# EAGLE design SympleSensorBoard (EAGLE 9.6.2)
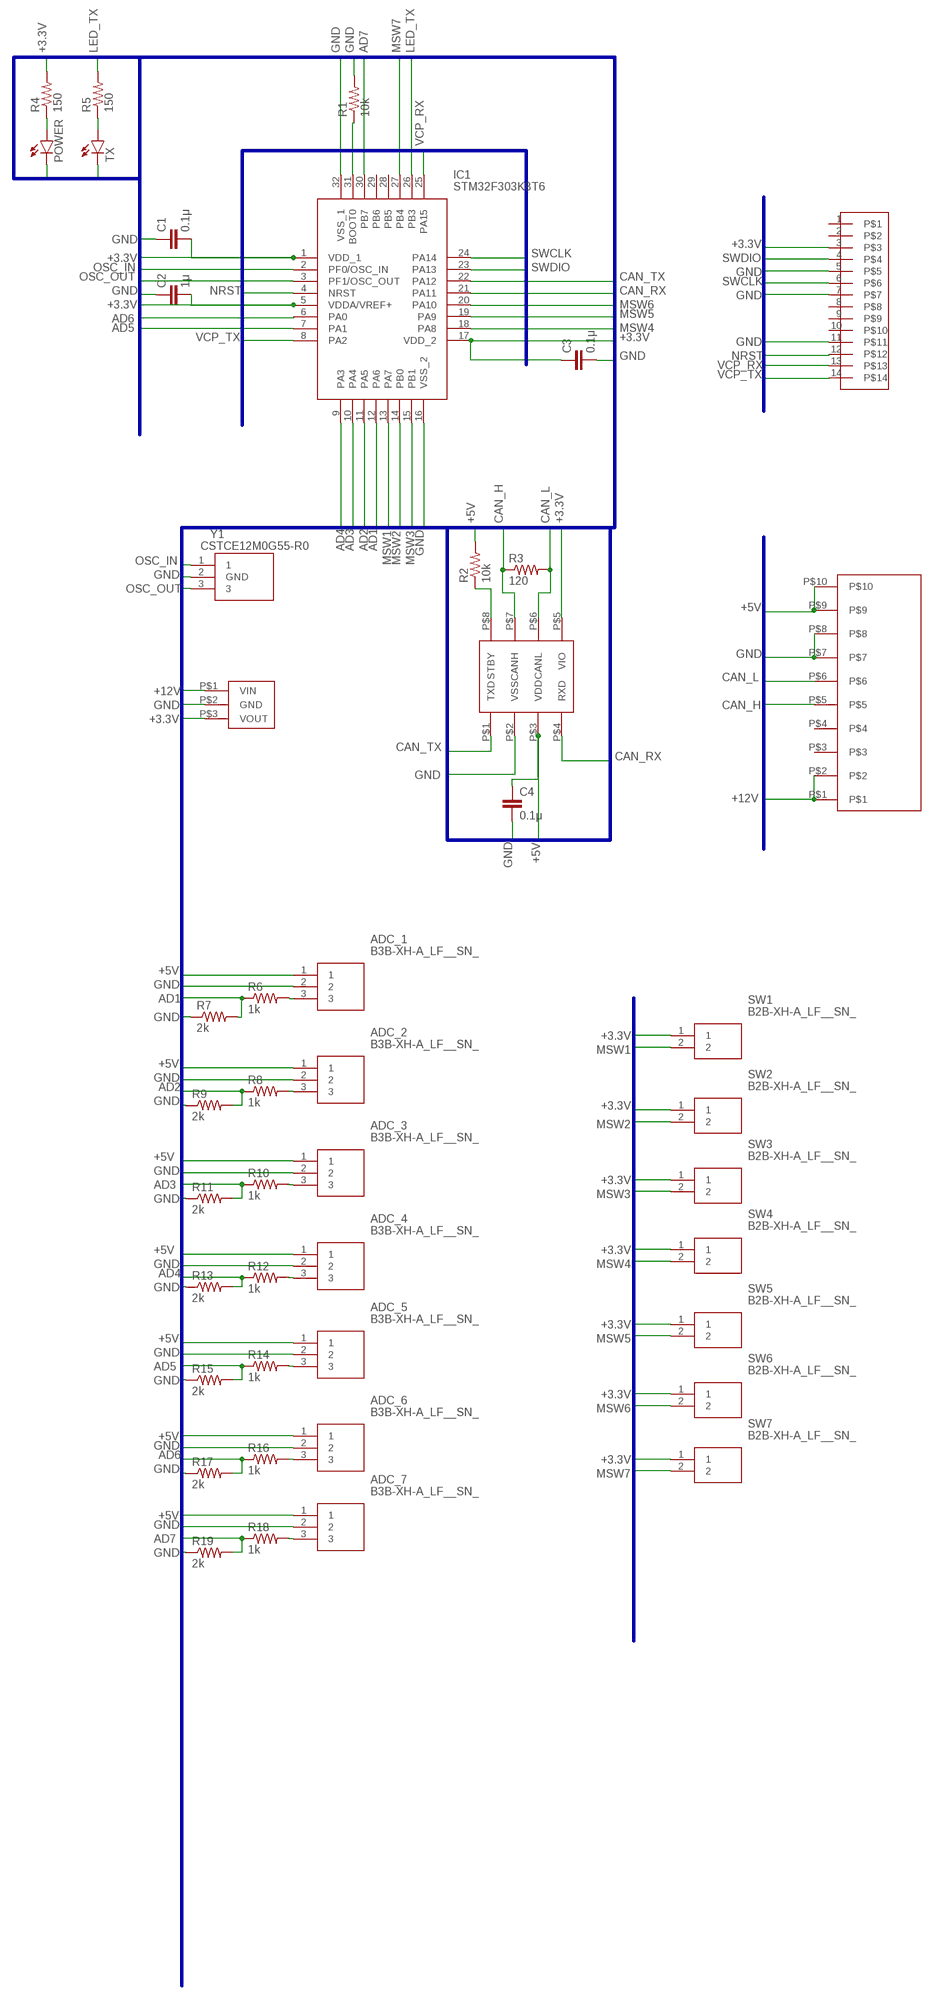
[diagram p0: schematic, sheet 1]

## Parts
ADC_1  B3B-XH-A_LF__SN_  [SHDR3W64P0X250_1X3_990X575X700]
ADC_2  B3B-XH-A_LF__SN_  [SHDR3W64P0X250_1X3_990X575X700]
ADC_3  B3B-XH-A_LF__SN_  [SHDR3W64P0X250_1X3_990X575X700]
ADC_4  B3B-XH-A_LF__SN_  [SHDR3W64P0X250_1X3_990X575X700]
ADC_5  B3B-XH-A_LF__SN_  [SHDR3W64P0X250_1X3_990X575X700]
ADC_6  B3B-XH-A_LF__SN_  [SHDR3W64P0X250_1X3_990X575X700]
ADC_7  B3B-XH-A_LF__SN_  [SHDR3W64P0X250_1X3_990X575X700]
C1  0.1μ  C-EUC0603  [C0603]
C2  1μ  C-EUC0603  [C0603]
C3  0.1μ  C-EUC0603  [C0603]
C4  0.1μ  C-EUC0603  [C0603]
IC1  STM32F303K8T6  [QFP80P900X900X160-32N]
POWER  LEDCHIP-LED0603  [CHIP-LED0603]
R1  10k  R-US_R0603  [R0603]
R2  10k  R-US_R0603  [R0603]
R3  120  R-US_R0603  [R0603]
R4  150  R-US_R0603  [R0603]
R5  150  R-US_R0603  [R0603]
R6  1k  R-US_R0603  [R0603]
R7  2k  R-US_R0603  [R0603]
R8  1k  R-US_R0603  [R0603]
R9  2k  R-US_R0603  [R0603]
R10  1k  R-US_R0603  [R0603]
R11  2k  R-US_R0603  [R0603]
R12  1k  R-US_R0603  [R0603]
R13  2k  R-US_R0603  [R0603]
R14  1k  R-US_R0603  [R0603]
R15  2k  R-US_R0603  [R0603]
R16  1k  R-US_R0603  [R0603]
R17  2k  R-US_R0603  [R0603]
R18  1k  R-US_R0603  [R0603]
R19  2k  R-US_R0603  [R0603]
SW1  B2B-XH-A_LF__SN_  [SHDR2W64P0X250_1X2_740X575X700]
SW2  B2B-XH-A_LF__SN_  [SHDR2W64P0X250_1X2_740X575X700]
SW3  B2B-XH-A_LF__SN_  [SHDR2W64P0X250_1X2_740X575X700]
SW4  B2B-XH-A_LF__SN_  [SHDR2W64P0X250_1X2_740X575X700]
SW5  B2B-XH-A_LF__SN_  [SHDR2W64P0X250_1X2_740X575X700]
SW6  B2B-XH-A_LF__SN_  [SHDR2W64P0X250_1X2_740X575X700]
SW7  B2B-XH-A_LF__SN_  [SHDR2W64P0X250_1X2_740X575X700]
TX  LEDCHIP-LED0603  [CHIP-LED0603]
U$1  BP5293-33  [DC/DC_REGULATOR_3P]
U$2  MCP2562MCP2561-SN  [SOIC8]
U$3  BOX14P  [CON_HEDA14P_1.27]
U$4  BOX10PBOX10P-L  [BOX10P-L]
Y1  CSTCE12M0G55-R0  [CSTCE12M0G55-R0]

## Nets
+3.3V: C1.2 C2.2 C3.1 IC1.1(VDD_1) IC1.5(VDDA/VREF+) IC1.17(VDD_2) R4.2 SW1.1 SW2.1 SW3.1 SW4.1 SW5.1 SW6.1 SW7.1 U$1.P$3(VOUT) U$2.P$5(VIO) U$3.3
+5V: ADC_1.1 ADC_2.1 ADC_3.1 ADC_4.1 ADC_5.1 ADC_6.1 ADC_7.1 C4.1 R2.2 U$2.P$3(VDD) U$4.P$9 U$4.P$10
+12V: U$1.P$1(VIN) U$4.P$1 U$4.P$2
AD1: IC1.12(PA6) R6.1 R7.2
AD2: IC1.11(PA5) R8.1 R9.2
AD3: IC1.10(PA4) R10.1 R11.2
AD4: IC1.9(PA3) R12.1 R13.2
AD5: IC1.7(PA1) R14.1 R15.2
AD6: IC1.6(PA0) R16.1 R17.2
AD7: IC1.30(PB7) R18.1 R19.2
CAN_H: R3.1 U$2.P$7(CANH) U$4.P$5
CAN_L: R3.2 U$2.P$6(CANL) U$4.P$6
CAN_RX: IC1.21(PA11) U$2.P$4(RXD)
CAN_TX: IC1.22(PA12) U$2.P$1(TXD)
GND: ADC_1.2 ADC_2.2 ADC_3.2 ADC_4.2 ADC_5.2 ADC_6.2 ADC_7.2 C1.1 C2.1 C3.2 C4.2 IC1.16(VSS_2) IC1.32(VSS_1) POWER.C R1.2 R7.1 R9.1 R11.1 R13.1 R15.1 R17.1 R19.1 TX.C U$1.P$2(GND) U$2.P$2(VSS) U$3.5 U$3.7 U$3.11 U$4.P$7 U$4.P$8 Y1.2(GND)
LED_TX: IC1.26(PB3) R5.2
MSW1: IC1.13(PA7) SW1.2
MSW2: IC1.14(PB0) SW2.2
MSW3: IC1.15(PB1) SW3.2
MSW4: IC1.18(PA8) SW4.2
MSW5: IC1.19(PA9) SW5.2
MSW6: IC1.20(PA10) SW6.2
MSW7: IC1.27(PB4) SW7.2
N$1: IC1.31(BOOT0) R1.1
N$2: R2.1 U$2.P$8(STBY)
N$3: POWER.A R4.1
N$4: R5.1 TX.A
N$5: ADC_1.3 R6.2
N$6: ADC_2.3 R8.2
N$7: ADC_3.3 R10.2
N$8: ADC_4.3 R12.2
N$9: ADC_5.3 R14.2
N$10: ADC_6.3 R16.2
N$20: ADC_7.3 R18.2
NRST: IC1.4(NRST) U$3.12
OSC_IN: IC1.2(PF0/OSC_IN) Y1.1
OSC_OUT: IC1.3(PF1/OSC_OUT) Y1.3
SWCLK: IC1.24(PA14) U$3.6
SWDIO: IC1.23(PA13) U$3.4
VCP_RX: IC1.25(PA15) U$3.13
VCP_TX: IC1.8(PA2) U$3.14
Unconnected: IC1.28(PB5) IC1.29(PB6) U$3.1 U$3.2 U$3.8 U$3.9 U$3.10 U$4.P$3 U$4.P$4

## Buses
+3.3V,GND,NRST,SWCLK,SWDIO,VCP_RX,VCP_TX
+3.3V,+5V,+12V,AD1,AD2,AD3,AD4,AD5,AD6,CAN_H,CAN_L,CAN_RX,CAN_TX,ECHO,GND,LED_TX,MSW1,MSW2,MSW3,MSW4,MSW5,MSW6,OSC_IN,OSC_OUT,SCL,SDA,TRIG
+3.3V,+5V,+12V,AD1,AD2,AD3,AD4,AD5,AD6,AD7,AD8,CAN_H,CAN_L,CAN_RX,CAN_TX,ECHO,GND,LED_TX,MSW1,MSW2,MSW3,MSW4,MSW5,MSW6,MSW7,MSW8,OSC_IN,OSC_OUT,SCL,SDA,TRIG

## Library data of the parts
ADC_1-ADC_7 = B3B-XH-A_LF__SN_:B3B-XH-A_LF__SN_: XH-2.5mm Header top entry 3 way JST XH Series, Series Number B3B, 2.5mm Pitch 3 Way 1 Row Straight PCB Header, Solder Termination, 3A Source: Datasheet <http://uk.rs-online.com/web/p/products/8201557P>; DESCRIPTION: XH-2.5mm Header top entry 3 way JST XH Series, Series Number B3B, 2.5mm Pitch 3 Way 1 Row Straight PCB Header, Solder Termination, 3A; HEIGHT: 7mm; MANUFACTURER_NAME: JST (JAPAN SOLDERLESS TERMINALS); MANUFACTURER_PART_NUMBER: B3B-XH-A(LF)(SN); RS_PART_NUMBER: 8201557P; RS_PRICE-STOCK: http://uk.rs-online.com/web/p/products/8201557P
C1-C4 = rcl:C-EU: CAPACITOR, European symbol; SPICEPREFIX: C
IC1 = STM32F303K8T6:STM32F303K8T6: ARM Microcontrollers - MCU 16/32-BITS MICROS Source: Datasheet; DESCRIPTION: ARM Microcontrollers - MCU 16/32-BITS MICROS; HEIGHT: 1.6mm; MANUFACTURER_NAME: STMicroelectronics; MANUFACTURER_PART_NUMBER: STM32F303K8T6
POWER TX = led:LED: LED OSRAM: - CHIPLED LG R971, LG N971, LY N971, LG Q971, LY Q971, LO R971, LY R971 LH N974, LH R974 LS Q976, LO Q976, LY Q976 LO Q996 - Hyper CHIPLED LW Q18S LB Q993, LB Q99A, LB R99A - SideLED LS A670, LO A670, LY A670, LG A670, LP A670 LB A673, LV A673, LT A673, LW A673 LH A674 LY A675 LS A676, LA A676, LO A676, LY A676, LW A676 LS A679, LY A679, LG A679 - Hyper Micro SIDELED® LS Y876, LA Y876, LO Y876, LY Y876 LT Y87S - SmartLED LW L88C, LW L88S LB L89C, LB L89S, LG L890 LS L89K, LO L89K, LY L89K LS L896, LA L896, LO L896, LY L896 - TOPLED LS T670, LO T670, LY T670, LG T670, LP T670 LSG T670, LSP T670, LSY T670, LOP T670, LYG T670 LG T671, LOG T671, LSG T671 LB T673, LV T673, LT T673, LW T673 LH T674 LS T676, LA T676, LO T676, LY T676, LB T676, LH T676, LSB T676, LW T676 LB T67C, LV T67C, LT T67C, LS T67K, LO T67K, LY T67K, LW E67C LS E67B, LA E67B, LO E67B, LY E67B, LB E67C, LV E67C, LT E67C LW T67C LS T679, LY T679, LG T679 LS T770, LO T770, LY T770, LG T770, LP T770 LB T773, LV T773, LT T773, LW T773 LH T774 LS E675, LA E675, LY E675, LS T675 LS T776, LA T776, LO T776, LY T776, LB T776 LHGB T686 LT T68C, LB T68C - Hyper Mini TOPLED® LB M676 - Mini TOPLED Santana® LG M470 LS M47K, LO M47K, LY M47K Source: http://www.osram.convergy.de LUXEON: - LUMILED® LXK2-PW12-R00, LXK2-PW12-S00, LXK2-PW14-U00, LXK2-PW14-V00 LXK2-PM12-R00, LXK2-PM12-S00, LXK2-PM14-U00 LXK2-PE12-Q00, LXK2-PE12-R00, LXK2-PE12-S00, LXK2-PE14-T00, LXK2-PE14-U00 LXK2-PB12-K00, LXK2-PB12-L00, LXK2-PB12-M00, LXK2-PB14-N00, LXK2-PB14-P00, LXK2-PB14-Q00 LXK2-PR12-L00, LXK2-PR12-M00, LXK2-PR14-Q00, LXK2-PR14-R00 LXK2-PD12-Q00, LXK2-PD12-R00, LXK2-PD12-S00 LXK2-PH12-R00, LXK2-PH12-S00 LXK2-PL12-P00, LXK2-PL12-Q00, LXK2-PL12-R00 Source: www.luxeon.com KINGBRIGHT: KA-3528ASYC Source: www.kingbright.com
R1-R19 = rcl:R-US_: RESISTOR, American symbol; SPICEPREFIX: R
SW1-SW7 = B2B-XH-A_LF__SN_:B2B-XH-A_LF__SN_: JST XH Series, 2.5mm Pitch 2 Way 1 Row Straight PCB Header, Solder Termination, 3A Source: Datasheet <http://uk.rs-online.com/web/p/products/8201554P>; DESCRIPTION: JST XH Series, 2.5mm Pitch 2 Way 1 Row Straight PCB Header, Solder Termination, 3A; HEIGHT: 7mm; MANUFACTURER_NAME: JST (JAPAN SOLDERLESS TERMINALS); MANUFACTURER_PART_NUMBER: B2B-XH-A(LF)(SN); RS_PART_NUMBER: 8201554P; RS_PRICE-STOCK: http://uk.rs-online.com/web/p/products/8201554P
U$1 = SympleEncoderBoard:BP5293-33
U$2 = user_ic:MCP2562
U$3 = user_conector:BOX14P
U$4 = user_conector:BOX10P
Y1 = CSTCE12M0G55-R0:CSTCE12M0G55-R0: SMT ceramic resonator 12.0MHz CSTCE12M0G55-R0, Ceramic Resonator, 12MHz Fundamental 33pF, 3-Pin Cap Chip, 3.2 x 1.3 x 0.7mm Source: Datasheet <http://uk.rs-online.com/web/p/products/7214809P>; DESCRIPTION: SMT ceramic resonator 12.0MHz CSTCE12M0G55-R0, Ceramic Resonator, 12MHz Fundamental 33pF, 3-Pin Cap Chip, 3.2 x 1.3 x 0.7mm; HEIGHT: mm; MANUFACTURER_NAME: Murata Electronics; MANUFACTURER_PART_NUMBER: CSTCE12M0G55-R0; RS_PART_NUMBER: 7214809P; RS_PRICE-STOCK: http://uk.rs-online.com/web/p/products/7214809P

## Board
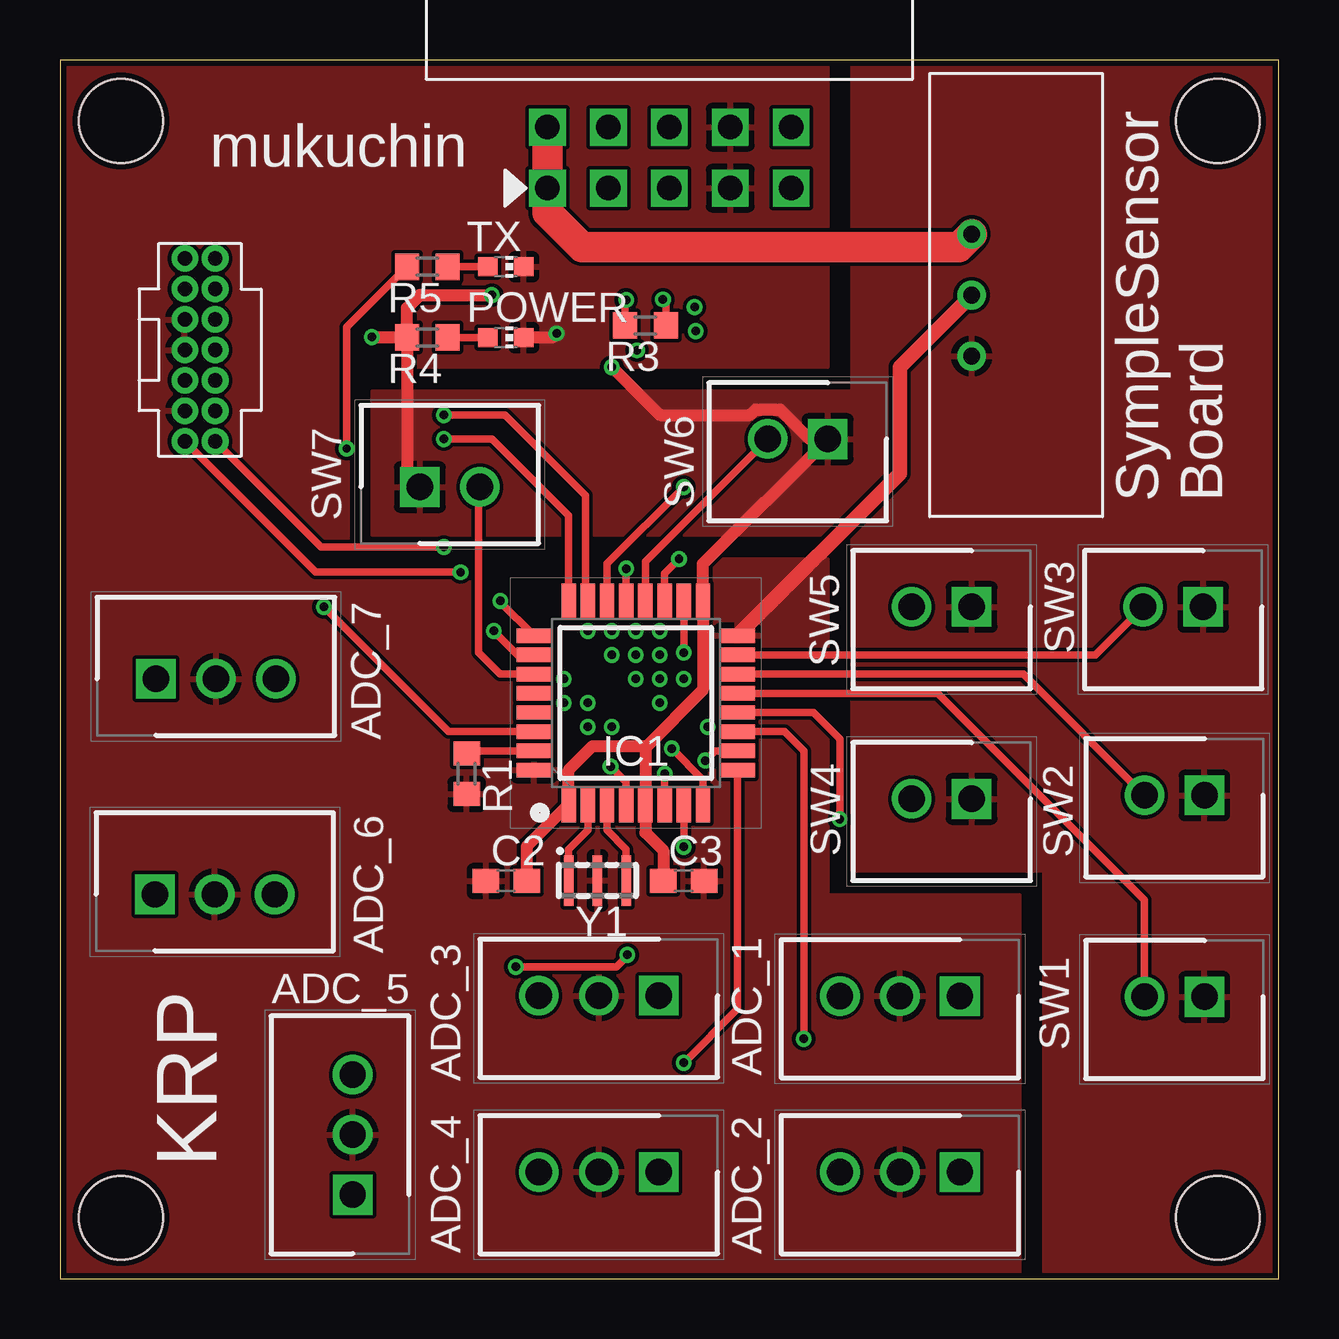
[diagram p1: board, top side]
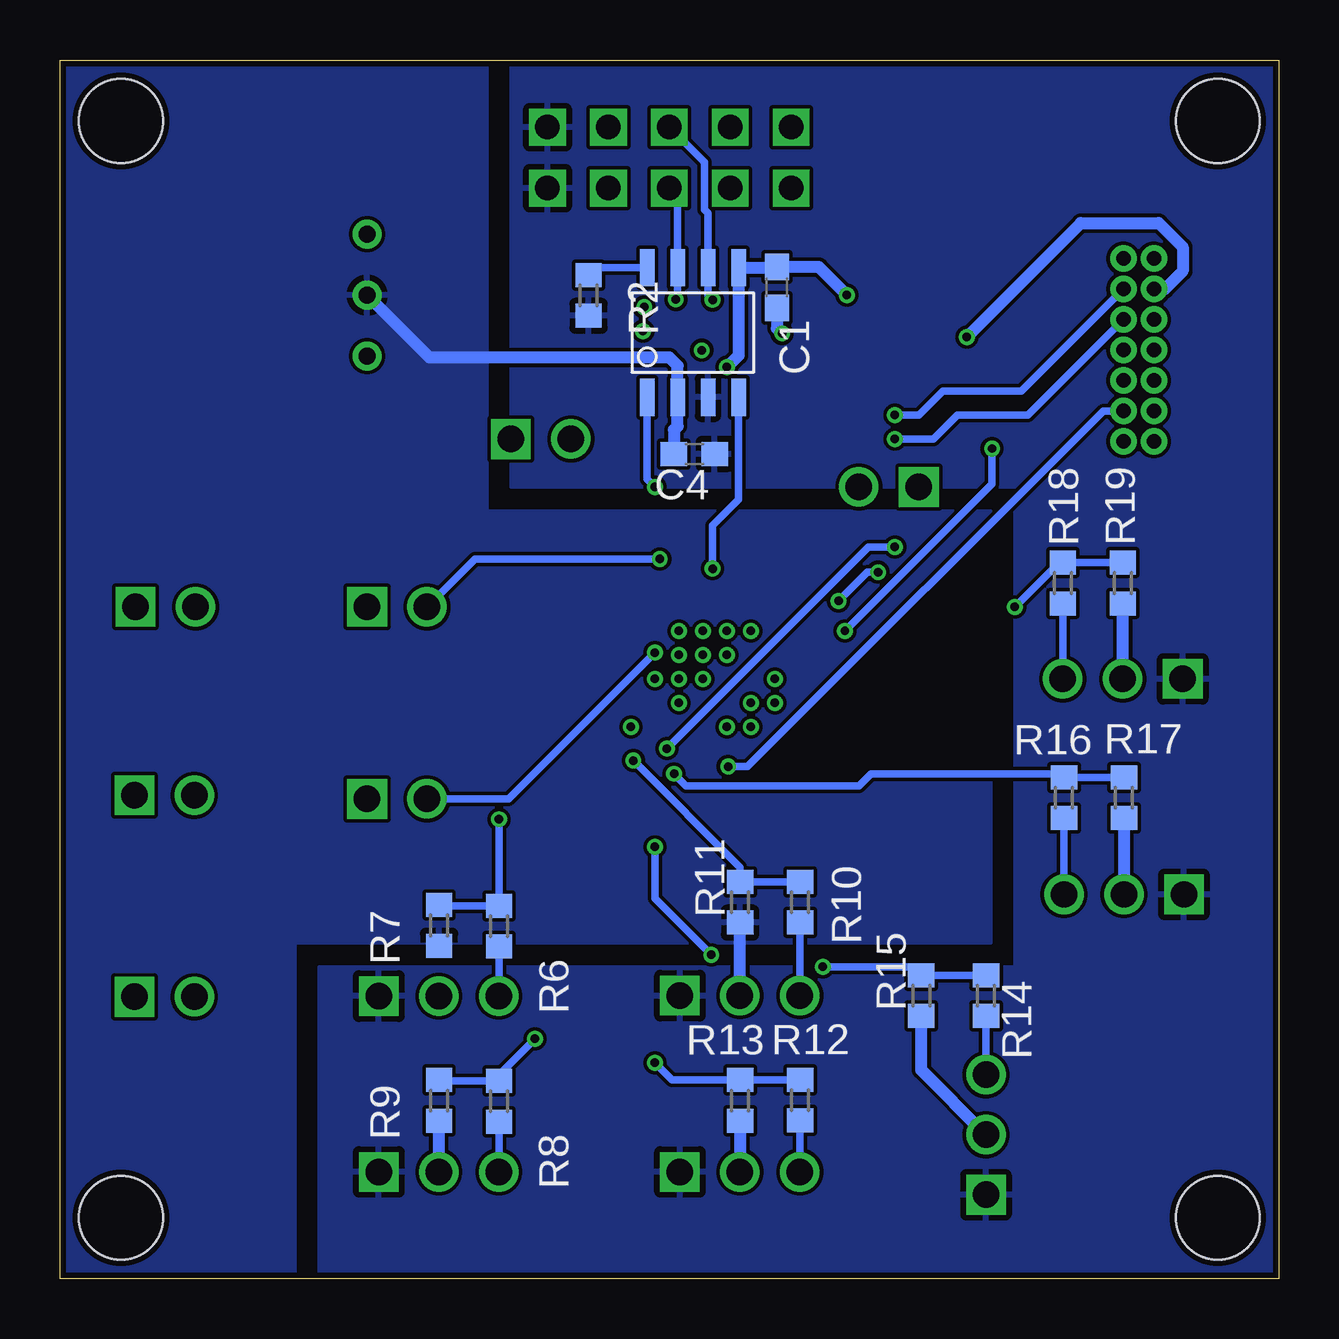
[diagram p2: board, bottom side, seen from below]

Size 50.8 x 50.8 mm. Coordinates in mm from the lower left corner, seen from the top.
Outline: 0,0 50.8,0 50.8,50.8 0,50.8 0,0
Copper layers (1*16): Top 0.035mm / dielectric 1.5mm / Bottom 0.035mm
Design rules "SeeedStudio_2layer_DRU_no_angle_20140221": minimum track width 6mil, minimum drill 12mil, track to track 6mil, track to pad 6mil, pad to pad 6mil, via to via 6mil, smd to smd 0mil, copper to edge 10mil, drill to drill 10mil, minimum pad ring 10mil, minimum via ring 6mil, stop-mask expansion 2mil, vias tented up to drill 100mil, thermal gap 10mil
Holes 3.5 mm at 48.26,48.26 48.26,2.54 2.54,2.54 2.54,48.26

### Footprints (pad centres in the part's own frame; a part is rotated, then mirrored left to right if it is on the bottom)
SHDR3W64P0X250_1X3_990X575X700 = drill 1.1 pad 1.65 square: 1 0,0 | drill 1.1 pad 1.65: 2 2.5,0; 3 5,0
C0603 = smd 1.1 x 1: 1 -0.85,0; 2 0.85,0
QFP80P900X900X160-32N = smd 1.475 x 0.6: 1 -4.238,2.8; 2 -4.238,2; 3 -4.238,1.2; 4 -4.238,0.4; 5 -4.238,-0.4; 6 -4.238,-1.2; 7 -4.238,-2; 8 -4.238,-2.8; 17 4.238,-2.8; 18 4.238,-2; 19 4.238,-1.2; 20 4.238,-0.4; 21 4.238,0.4; 22 4.238,1.2; 23 4.238,2; 24 4.238,2.8 | smd 0.6 x 1.475: 9 -2.8,-4.238; 10 -2,-4.238; 11 -1.2,-4.238; 12 -0.4,-4.238; 13 0.4,-4.238; 14 1.2,-4.238; 15 2,-4.238; 16 2.8,-4.238; 25 2.8,4.238; 26 2,4.238; 27 1.2,4.238; 28 0.4,4.238; 29 -0.4,4.238; 30 -1.2,4.238; 31 -2,4.238; 32 -2.8,4.238
CHIP-LED0603 = smd 0.8 x 0.8: A 0,-0.75; C 0,0.75
R0603 = smd 1 x 1.1: 1 -0.85,0; 2 0.85,0
SHDR2W64P0X250_1X2_740X575X700 = drill 1.1 pad 1.65 square: 1 0,0 | drill 1.1 pad 1.65: 2 2.5,0
DC/DC_REGULATOR_3P = drill 0.7: P$1 -2.54,0; P$2 0,0; P$3 2.54,0
SOIC8 = smd 1.55 x 0.6: P$1 -2.7,1.905; P$2 -2.7,0.635; P$3 -2.7,-0.635; P$4 -2.7,-1.905; P$5 2.7,-1.905; P$6 2.7,-0.635; P$7 2.7,0.635; P$8 2.7,1.905
CON_HEDA14P_1.27 = drill 0.6: 1 1.08,8.255; 2 2.35,8.255; 3 1.08,6.985; 4 2.35,6.985; 5 1.08,5.715; 6 2.35,5.715; 7 1.08,4.445; 8 2.35,4.445; 9 1.08,3.175; 10 2.35,3.175; 11 1.08,1.905; 12 2.35,1.905; 13 1.08,0.635; 14 2.35,0.635
BOX10P-L = drill 1.02 square: P$1 5.08,2.54; P$2 5.08,0; P$3 2.54,2.54; P$4 2.54,0; P$5 0,2.54; P$6 0,0; P$7 -2.54,2.54; P$8 -2.54,0; P$9 -5.08,2.54; P$10 -5.08,0
CSTCE12M0G55-R0 = smd 0.4 x 2.1: 1 -1.2,0; 2 0,0; 3 1.2,0

### Placement (x,y rotation side)
ADC_1  37.51,11.78 180 top
ADC_2  37.51,4.45 180 top
ADC_3  24.96,11.8 180 top
ADC_4  24.96,4.45 180 top
ADC_5  12.2,3.5 90 top
ADC_6  3.95,16.02 0 top
ADC_7  4,25 0 top
C1  20.92,41.32 90 bottom
C2  18.6,16.58 0 top
C3  26,16.58 0 top
C4  24.36,34.38 180 bottom
IC1  24,24 90 top
POWER  18.58,39.23 270 top
R1  16.95,21.05 270 top
R2  28.77,40.99 270 bottom
R3  24.4,39.73 180 top
R4  15.31,39.23 180 top
R5  15.31,42.18 180 top
R6  32.5,14.7 270 bottom
R7  35,14.73 90 bottom
R8  32.5,7.4 270 bottom
R9  35,7.43 90 bottom
R10  19.95,15.7 270 bottom
R11  22.45,15.7 90 bottom
R12  19.95,7.45 270 bottom
R13  22.45,7.43 90 bottom
R14  12.2,11.8 270 bottom
R15  14.9,11.8 90 bottom
R16  8.95,20.05 270 bottom
R17  6.45,20.05 90 bottom
R18  9,29 270 bottom
R19  6.5,29 90 bottom
SW1  47.7,11.75 180 top
SW2  47.7,20.15 180 top
SW3  47.65,28 180 top
SW4  38,20 180 top
SW5  38,28 180 top
SW6  32,35 180 top
SW7  15,33 0 top
TX  18.58,42.18 270 top
U$1  38,41 270 top
U$2  24.42,39.44 90 bottom
U$3  4.12,34.27 0 top
U$4  25.4,48 180 top
Y1  22.4,16.6 0 top

### Tracks (layer width: path | path; a pad name or v marks a point on that pad's centre or on a via)
+3.3V  (via drill 0.35)
  Top 0.508: 24.4,22.15 24.4,22.2 22.2,22.2 21.2,21.2 IC1.1 19.45,18.01 C2.2 | 24.4,22.15 IC1.5 24.4,18.6 25.15,17.85 C3.1 | 24.4,22.15 26.8,24.55 IC1.17 26.8,29.8 SW6.1 31.24,35 30.01,36.23 28.99,36.23 28.76,36 25,36 v23,38 | R4.2 14.46,33.54 SW7.1 | R4.2 13.02,39.23 v13,39.25 | R4.2 14.46,40.46 15,41 v18,41
  Bottom 0.508: v13,39.25 8.25,44 5,44 4,43 4,42 4.75,41.26 U$3.3 | v18,41 19.17,42.17 C1.2 20.95,42.14 U$2.P$5 22.52,38.48 v23,38
  pour Top: 51,51 51,0 41,0 41,17 33,17 33,31 13,31 13,36 13,37 33,37 33,51
+5V
  pour Bottom: 32,33 32,51 0,51 0,0 40,0 40,13 11,13 11,33
+12V
  Top 1.27: U$1.P$1 37.46,43 21.75,43 20.32,44.43 U$4.P$1 U$4.P$2
AD1  (via drill 0.35)
  Top 0.305: IC1.12 31.4,23.6 32.5,22.5 v32.5,19.15
  Bottom 0.305: v32.5,19.15 R6.1 34.97,15.55 R7.2
AD2  (via drill 0.35)
  Top 0.305: IC1.11 30.2,22.8 31,22 v31,10
  Bottom 0.305: v31,10 32.5,8.5 R8.1 34.97,8.25 R9.2
AD3  (via drill 0.35)
  Top 0.305: IC1.10 27.3,22 v26.9,21.6
  Bottom 0.305: v26.9,21.6 22.45,17.15 R11.2 R10.1
AD4  (via drill 0.35)
  Top 0.305: IC1.9 28.24,11.24 v26,9
  Bottom 0.305: v26,9 25.28,8.28 R13.2 19.97,8.28 R12.1
AD5  (via drill 0.35)
  Top 0.305: IC1.7 v26,18 | v23.65,13.5 23.65,13.45 23.2,13 v19,13
  Bottom 0.305: R14.1 R15.2 15.25,13 v19,13 | v26,18 26,15.85 v23.65,13.5
AD6  (via drill 0.35)
  Top 0.305: IC1.6 v25.2,21.04 v25.2,21.05
  Bottom 0.305: R17.2 R16.1 9.1,21.05 17,21.05 17.5,20.55 24.7,20.55 v25.2,21.05
AD7  (via drill 0.35)
  Top 0.305: IC1.30 16.2,22.8 v11,28
  Bottom 0.305: R19.2 R18.1 9.15,29.85 v11,28
CAN_H  (via drill 0.35)
  Top 0.305: v25.13,40.82 25.25,40.7 R3.1
  Bottom 0.305: v25.13,40.82 25.05,40.9 U$2.P$7 25.05,45.12 U$4.P$5
CAN_L  (via drill 0.35)
  Top 0.305: v23.6,40.8 23.55,40.75 R3.2
  Bottom 0.305: v23.6,40.8 23.79,40.98 U$2.P$6 23.79,44.42 23.93,44.57 23.93,46.53 U$4.P$6
CAN_RX  (via drill 0.35)
  Top 0.305: v23.6,29.6 IC1.21
  Bottom 0.305: U$2.P$4 22.52,32.48 23.6,31.4 v23.6,29.6
CAN_TX  (via drill 0.35)
  Top 0.305: IC1.22 22.8,29.8 v26,33
  Bottom 0.305: U$2.P$1 26.32,33.33 v26,33
GND  (via drill 0.35)
  Top 0.508: v20.7,39.4 20.53,39.23 POWER.C
  Top 0.61: IC1.16 35,33.56 35,38 U$1.P$2
  Bottom 0.508: C4.2 25.21,35.38 25.05,35.53 U$2.P$2 25.05,38.05 25.4,38.4 35.4,38.4 U$1.P$2 | R13.1 ADC_4.2 | C1.1 20.92,39.62 v20.7,39.4 | R9.1 ADC_2.2 | ADC_3.2 R11.1 | R17.1 ADC_6.2 | ADC_7.2 R19.1 | ADC_5.2 14.9,8.7 R15.1
  pour Top: 32,51 32,38 12,38 12,30 32,30 32,16 40,16 40,0 0,0 0,51
  pour Bottom: 33,51 33,32 12,32 12,14 41,14 41,0 51,0 51,51
LED_TX  (via drill 0.35)
  Top 0.305: IC1.26 19.08,26 v18.08,27 | v11.95,34.6 11.95,39.67 R5.2
  Bottom 0.305: v18.08,27 11.95,33.13 v11.95,34.6
MSW1
  Top 0.305: IC1.13 36.6,24.4 45.2,15.8 SW1.2
MSW2
  Top 0.305: IC1.14 40.15,25.2 SW2.2
MSW3
  Top 0.305: SW3.2 43.15,26 IC1.15
MSW4  (via drill 0.35)
  Top 0.305: IC1.18 v26,26.1
  Bottom 0.305: SW4.2 32.1,20 v26,26.1
MSW5  (via drill 0.35)
  Top 0.305: IC1.19 25.2,29.4 v25.8,30
  Bottom 0.305: v25.8,30 33.5,30 SW5.2
MSW6
  Top 0.305: IC1.20 24.4,29.9 SW6.2
MSW7
  Top 0.305: IC1.27 18.35,25.2 17.45,26.1 17.45,32.95 SW7.2
N$1
  Top 0.305: IC1.31 17.05,22 R1.1
N$2
  Bottom 0.305: U$2.P$8 28.47,42.14 R2.1
N$3
  Top 0.305: R4.1 POWER.A
N$4
  Top 0.305: R5.1 TX.A
N$5
  Bottom 0.305: R6.2 ADC_1.3
N$6
  Bottom 0.305: R8.2 ADC_2.3
N$7
  Bottom 0.305: R10.2 ADC_3.3
N$8
  Bottom 0.305: R12.2 ADC_4.3
N$9
  Bottom 0.305: ADC_5.3 R14.2
N$10
  Bottom 0.305: R16.2 ADC_6.3
N$11  (via drill 0.35)
  other vias: 23,26
N$12  (via drill 0.35)
  other vias: 22,27
N$13  (via drill 0.35)
  other vias: 23,27
N$14  (via drill 0.35)
  other vias: 24,27
N$15  (via drill 0.35)
  other vias: 24,26
N$16  (via drill 0.35)
  other vias: 24,25
N$17  (via drill 0.35)
  other vias: 25,27
N$18  (via drill 0.35)
  other vias: 25,26
N$19  (via drill 0.35)
  other vias: 25,25
N$20
  Bottom 0.305: R18.2 ADC_7.3
N$21  (via drill 0.35)
  other vias: 25,24
N$22  (via drill 0.35)
  other vias: 26,25
N$23  (via drill 0.35)
  other vias: 27,23
N$24  (via drill 0.35)
  other vias: 21,25
N$25  (via drill 0.35)
  other vias: 21,24
N$26  (via drill 0.35)
  other vias: 22,24
N$27  (via drill 0.35)
  other vias: 23,23
N$28  (via drill 0.35)
  other vias: 22,23
N$29  (via drill 0.35)
  other vias: 26.45,40.5
N$30  (via drill 0.35)
  other vias: 26.5,39.5
N$31  (via drill 0.35)
  other vias: 24.05,38.7
NRST  (via drill 0.35)
  Top 0.305: IC1.4 23.6,20.7 v22.95,21.35
  Bottom 0.305: v22.95,21.35 22.14,21.35 7.31,36.17 U$3.12
OSC_IN
  Top 0.305: Y1.1 21.2,17.9 22,18.7 IC1.2
OSC_OUT
  Top 0.305: Y1.3 23.6,17.9 22.8,18.7 IC1.3
SWCLK  (via drill 0.35)
  Top 0.305: IC1.24 21.2,31.8 18,35 v16,35
  Bottom 0.305: v16,35 14.4,35 13.4,36 10.46,36 U$3.6
SWDIO  (via drill 0.35)
  Top 0.305: IC1.23 21.9,28.34 21.9,32.65 18.55,36 v16,36
  Bottom 0.305: v16,36 15,36 14,37 10.72,37 U$3.4
VCP_RX  (via drill 0.35)
  Top 0.305: IC1.25 18.35,28.21 v18.35,28.25 | v16.7,29.45 10.65,29.45 U$3.13
  Bottom 0.305: v18.35,28.25 17.15,29.45 v16.7,29.45
VCP_TX  (via drill 0.35)
  Top 0.305: IC1.8 26.8,20.8 v25.5,22.1 | v16,30.5 10.88,30.5 U$3.14
  Bottom 0.305: v25.5,22.1 17.1,30.5 v16,30.5

### Text on the board
tNames: mukuchin | SympleSensor / Board | KRP